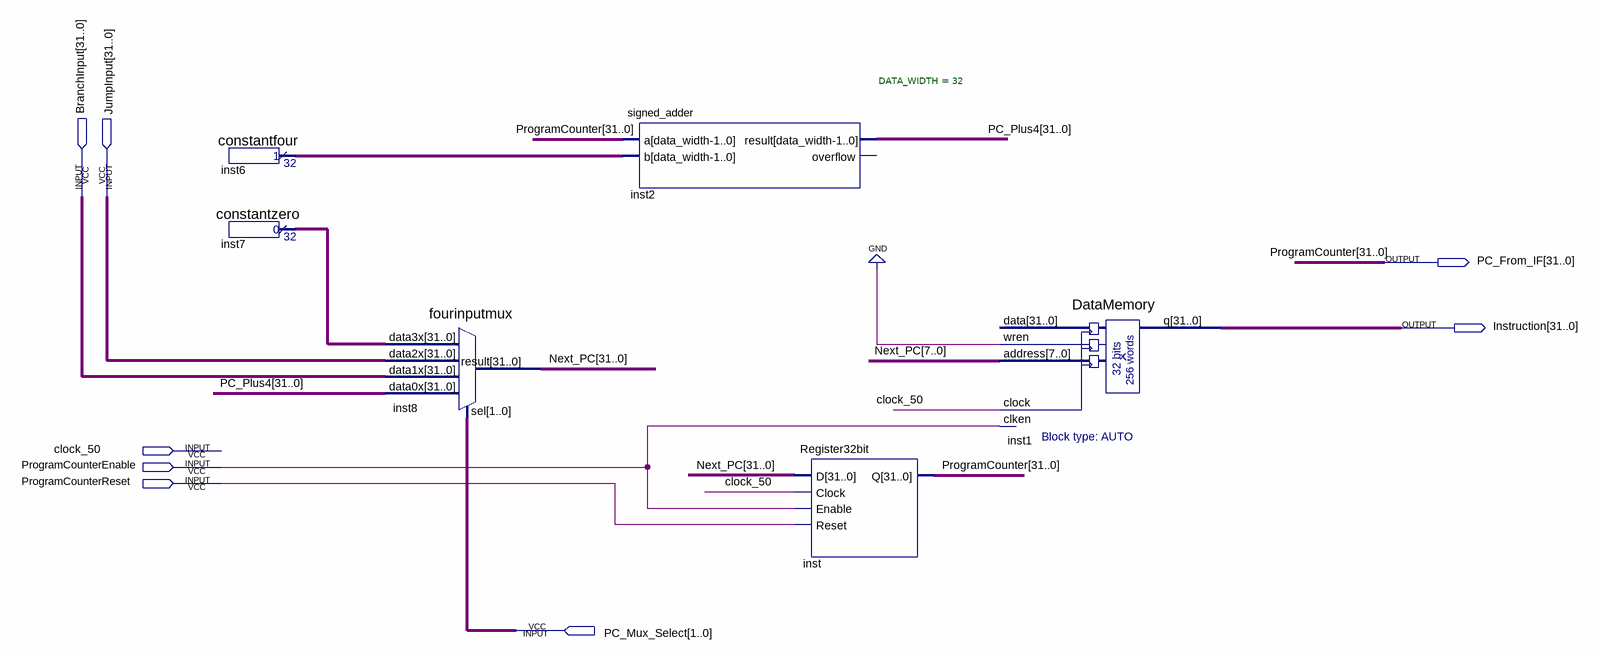
[diagram p0: schematic sheet]
// Quartus schematic InstructionFetch_Stage.bdf as structural Verilog: 6 symbols, 8 pins
module InstructionFetch_Stage (
  input  [31:0] BranchInput,
  input  [31:0] JumpInput,
  input  clock_50,
  input  ProgramCounterEnable,
  input  ProgramCounterReset,
  input  [1:0] PC_Mux_Select,
  output [31:0] PC_From_IF,
  output [31:0] Instruction
);

  wire [31:0] inst6_result, inst7_result, Next_PC, PC_Plus4;

  constantfour inst6 (.result(inst6_result));
  constantzero inst7 (.result(inst7_result));
  fourinputmux inst8 (
    .data3x(inst7_result), .data2x(JumpInput), .data1x(BranchInput), .data0x(PC_Plus4), .sel(PC_Mux_Select),
    .result(Next_PC));
  signed_adder #(.DATA_WIDTH(32)) inst2 (.a(PC_From_IF), .b(inst6_result), .result(PC_Plus4));  // open: overflow
  Register32bit inst (
    .D(Next_PC), .Clock(clock_50), .Enable(ProgramCounterEnable), .Reset(ProgramCounterReset), .Q(PC_From_IF));
  DataMemory inst1 (
    .wren(1'b0), .address(Next_PC[7:0]), .clock(clock_50), .clken(ProgramCounterEnable), .q(Instruction));  // open: data

  // Other names for the same wires on the sheet: ProgramCounter[31:0] = PC_From_IF
endmodule
